# EAGLE design simple_flip_flop (EAGLE 8.6.3)
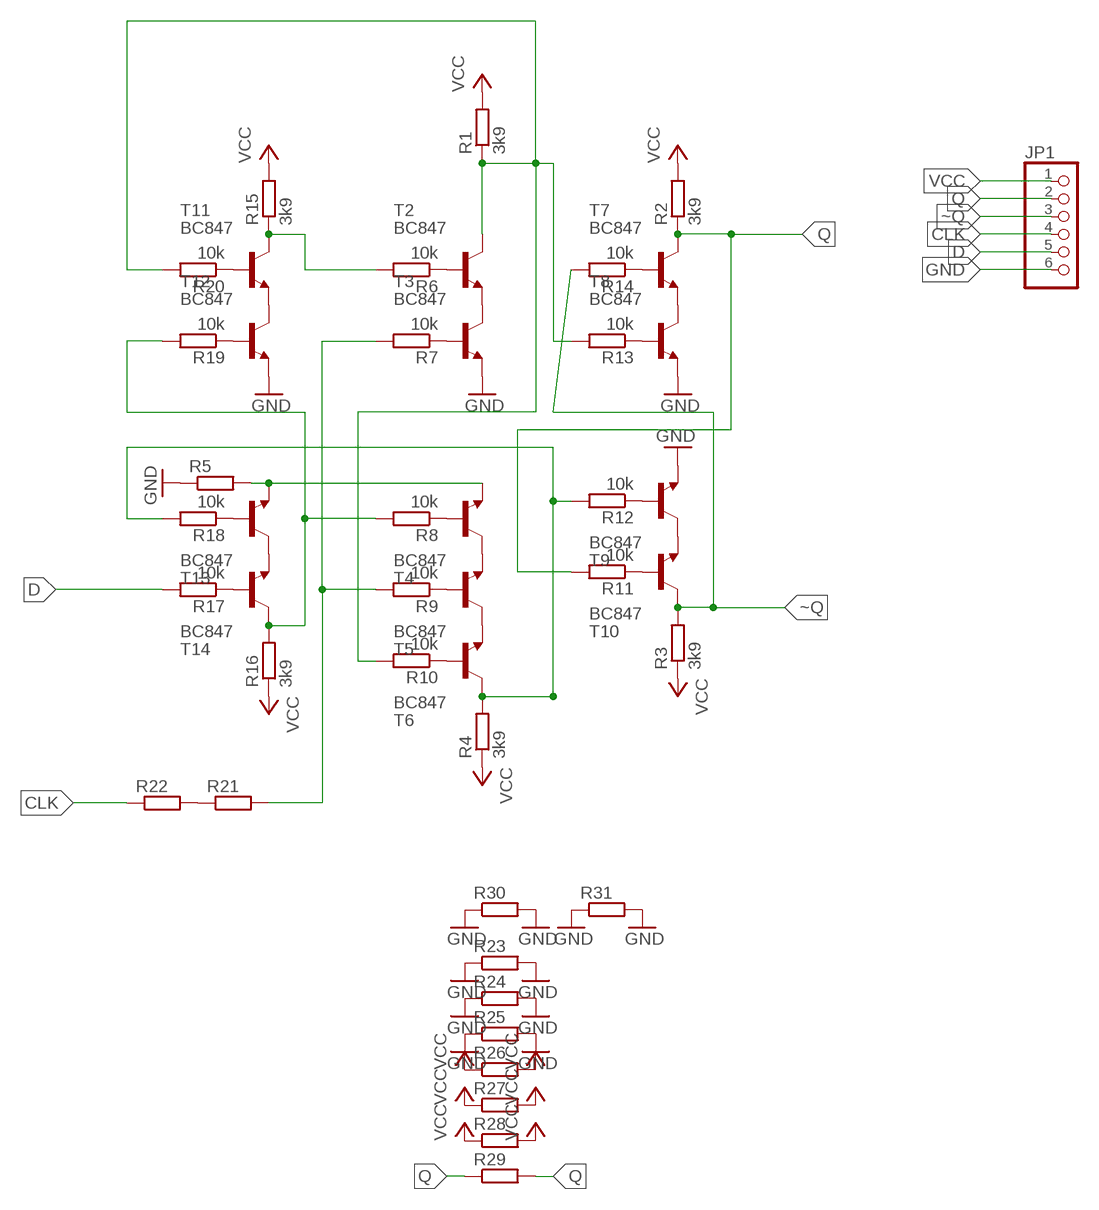
[diagram p0: schematic, sheet 1]

## Parts
JP1  PINHD-1X06_2.54-SMD  [1X06SMD]
R1  3k9  R-EU_R0805W  [R0805W]
R2  3k9  R-EU_R0805W  [R0805W]
R3  3k9  R-EU_R0805W  [R0805W]
R4  3k9  R-EU_R0805W  [R0805W]
R5  R-EU_R1206  [R1206]
R6  10k  R-EU_R0805W  [R0805W]
R7  10k  R-EU_R0805W  [R0805W]
R8  10k  R-EU_R0805W  [R0805W]
R9  10k  R-EU_R0805W  [R0805W]
R10  10k  R-EU_R0805W  [R0805W]
R11  10k  R-EU_R0805W  [R0805W]
R12  10k  R-EU_R0805W  [R0805W]
R13  10k  R-EU_R0805W  [R0805W]
R14  10k  R-EU_R0805W  [R0805W]
R15  3k9  R-EU_R0805W  [R0805W]
R16  3k9  R-EU_R0805W  [R0805W]
R17  10k  R-EU_R0805W  [R0805W]
R18  10k  R-EU_R0805W  [R0805W]
R19  10k  R-EU_R0805W  [R0805W]
R20  10k  R-EU_R0805W  [R0805W]
R21  R-EU_R1206  [R1206]
R22  R-EU_R1206  [R1206]
R23  R-EU_R1206  [R1206]
R24  R-EU_R1206  [R1206]
R25  R-EU_R1206  [R1206]
R26  R-EU_R1206  [R1206]
R27  R-EU_R1206  [R1206]
R28  R-EU_R1206  [R1206]
R29  R-EU_R1206  [R1206]
R30  R-EU_R1206  [R1206]
R31  R-EU_R1206  [R1206]
T2  BC847  [SOT23]
T3  BC847  [SOT23]
T4  BC847  [SOT23]
T5  BC847  [SOT23]
T6  BC847  [SOT23]
T7  BC847  [SOT23]
T8  BC847  [SOT23]
T9  BC847  [SOT23]
T10  BC847  [SOT23]
T11  BC847  [SOT23]
T12  BC847  [SOT23]
T13  BC847  [SOT23]
T14  BC847  [SOT23]

## Nets
CLK: JP1.4 R22.1
D: JP1.5 R17.2
GND: JP1.6 R5.1 R23.1 R23.2 R24.1 R24.2 R25.1 R25.2 R30.1 R30.2 R31.1 R31.2 T3.2(E) T8.2(E) T9.2(E) T12.2(E)
N$1: R5.2 T4.2(E) T13.2(E)
N$2: T2.2(E) T3.3(C)
N$3: T4.3(C) T5.2(E)
N$4: T5.3(C) T6.2(E)
N$5: T7.2(E) T8.3(C)
N$6: T9.3(C) T10.2(E)
N$7: R1.1 R10.2 R13.2 R20.2 T2.3(C)
N$8: R21.1 R22.2
N$10: R4.2 R12.2 R18.2 T6.3(C)
N$12: R6.1 T2.1(B)
N$13: R7.1 T3.1(B)
N$14: R8.1 T4.1(B)
N$15: R9.1 T5.1(B)
N$16: R10.1 T6.1(B)
N$17: R11.1 T10.1(B)
N$18: R12.1 T9.1(B)
N$19: R13.1 T8.1(B)
N$20: R14.1 T7.1(B)
N$23: T11.2(E) T12.3(C)
N$24: T13.3(C) T14.2(E)
N$26: R6.2 R15.1 T11.3(C)
N$27: R8.2 R16.2 R19.2 T14.3(C)
N$29: R17.1 T14.1(B)
N$30: R18.1 T13.1(B)
N$31: R19.1 T12.1(B)
N$32: R20.1 T11.1(B)
Q: JP1.2 R2.1 R11.2 R29.1 R29.2 T7.3(C)
S%9: R7.2 R9.2 R21.2
VCC: JP1.1 R1.2 R2.2 R3.1 R4.1 R15.2 R16.1 R26.1 R26.2 R27.1 R27.2 R28.1 R28.2
~Q: JP1.3 R3.2 R14.2 T10.3(C)

## Library data of the parts
JP1 = pinhead-2:PINHD-1X06: PIN HEADER
R1-R4 R6-R20 R29 = rcl:R-EU_: RESISTOR, European symbol; SPICEPREFIX: R
R5 R21-R28 R30 R31 = resistor:R-EU_: RESISTOR, European symbol
T2-T14 = transistor-neu-to92:BC847: NPN TRANSISTOR

## Board
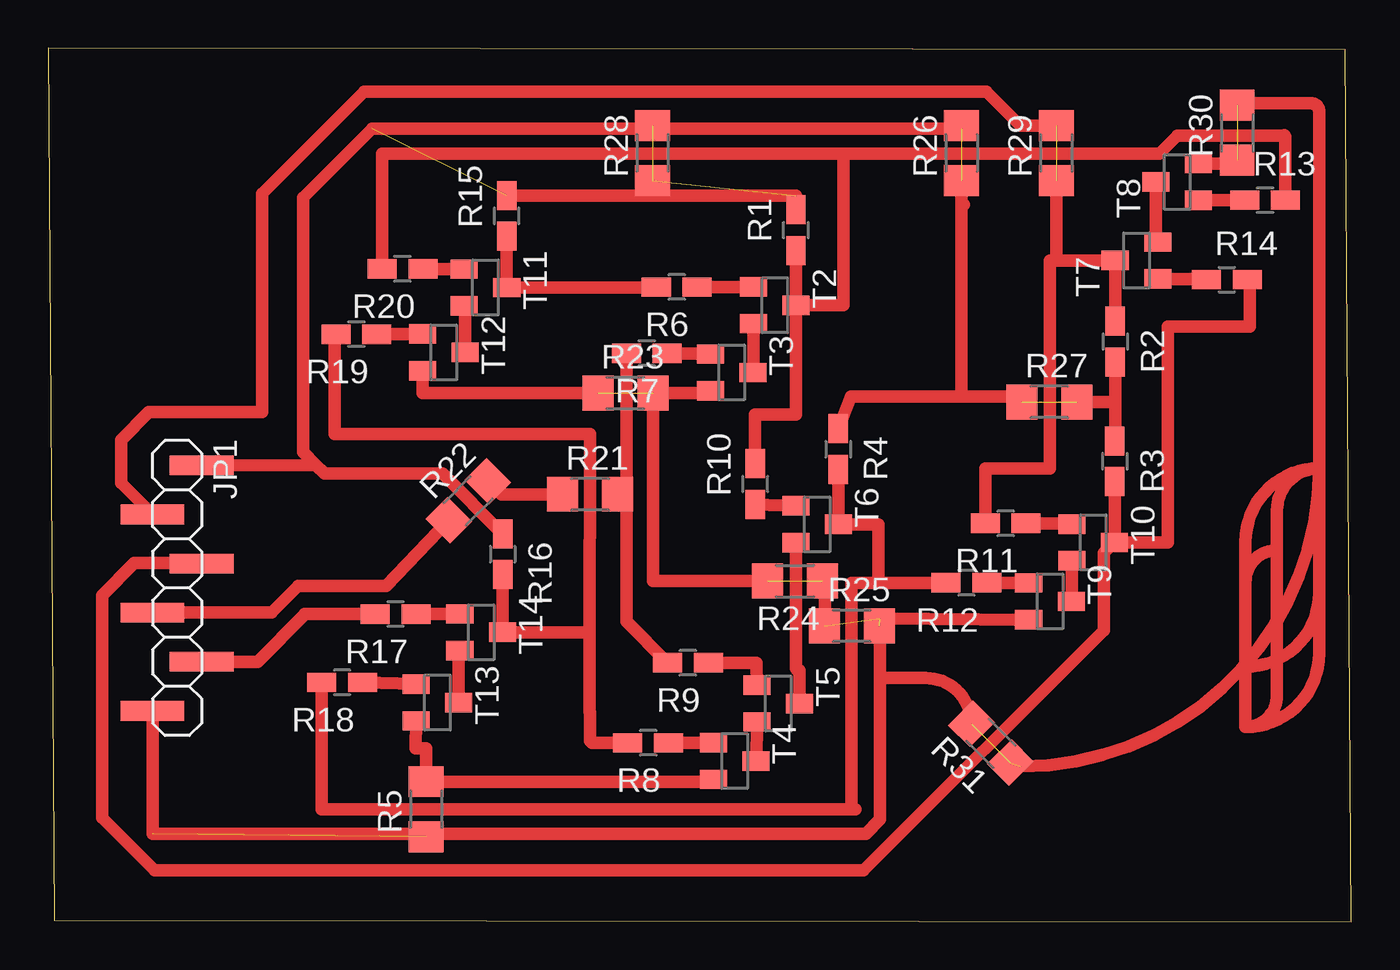
[diagram p1: board, top side]

Size 67.37 x 45.16 mm. Coordinates in mm from the lower left corner, seen from the top.
Outline: 0.3,0.08 67.37,0 67.06,45.08 0,45.16 0.3,0.08
Copper layers (1*16): Top 0.035mm / dielectric 1.5mm / Bottom 0.035mm
Design rules "default *": minimum track width 25mil, minimum drill 0.35mm, track to track 25mil, track to pad 25mil, pad to pad 20mil, via to via 25mil, smd to smd 25mil, copper to edge 40mil, drill to drill 6mil, minimum pad ring 10mil, minimum via ring 8mil, stop-mask expansion 4mil, vias tented up to drill 0mil, thermal gap 10mil

### Footprints (pad centres in the part's own frame; a part is rotated, then mirrored left to right if it is on the bottom)
1X06SMD = smd 1.016 x 3.302: 1 -1.27,1.27; 2 1.27,-1.27; 3 3.81,1.27; 4 6.35,-1.27; 5 8.89,1.27; 6 11.43,-1.27
R0805W = smd 1.5 x 1: 1 -1.052,0; 2 1.052,0
R1206 = smd 1.6 x 1.803: 1 -1.422,0; 2 1.422,0
SOT23 = smd 1 x 1.4: 1 -0.95,-1.1; 2 0.95,-1.1; 3 0,1.1

### Placement (x,y rotation side)
JP1  6.65,22.33 270 top
R1  38.66,35.76 90 top
R2  55.17,30 270 top
R3  55.14,23.8 270 top
R4  40.84,24.43 270 top
R5  19.53,5.82 90 top
R6  32.49,32.82 180 top
R7  30.94,29.39 180 top
R8  31.01,9.25 180 top
R9  33.07,13.39 180 top
R10  36.55,22.63 90 top
R11  49.5,20.6 180 top
R12  47.47,17.53 180 top
R13  62.92,37.31 0 top
R14  60.93,33.2 0 top
R15  23.7,36.5 90 top
R16  23.5,19 270 top
R17  17.96,15.9 180 top
R18  15.19,12.37 180 top
R19  15.93,30.38 180 top
R20  18.31,33.76 180 top
R21  28.02,22.1 0 top
R22  21.72,21.76 45 top
R23  29.84,27.33 0 top
R24  38.6,17.61 180 top
R25  41.55,15.29 0 top
R26  47.22,39.75 90 top
R27  51.77,26.87 0 top
R28  31.24,39.75 90 top
R29  52.12,39.75 90 top
R30  61.47,40.79 90 top
R31  48.74,9.23 135 top
T2  37.57,31.88 270 top
T3  35.33,28.4 270 top
T4  35.48,8.31 270 top
T5  37.74,11.28 270 top
T6  39.75,20.55 270 top
T7  56.26,34.19 90 top
T8  58.37,38.25 90 top
T9  51.79,16.56 270 top
T10  54.03,19.61 270 top
T11  22.61,32.79 270 top
T12  20.45,29.44 270 top
T13  20.12,11.33 270 top
T14  22.38,14.96 270 top

### Tracks (layer width: path | path; a pad name or v marks a point on that pad's centre or on a via)
CLK
  Top 0.635: R22.1 17.46,17.35 12.92,17.35 11.54,15.98 JP1.4
D
  Top 0.635: JP1.5 10.82,13.44 13.26,15.87 13.26,15.9 R17.2
GND  (8 unrouted)
  Top 0.635: 43.01,12.6 43.01,5.29 42.27,4.55 5.38,4.55 JP1.6 | 43.01,12.6 43.01,15.67 T9.2 | R23.1 19.35,27.33 T12.2 | T3.2 34.23,27.33 R23.2 31.27,17.61 R24.2 | R24.1 arc-90 40.18,17.45 R25.1 | T8.2 61.3,39.2 R30.1 | R30.2 arc-90 61.57,42.32 65.3,42.32 arc-90 65.71,41.91 65.71,23.44 | 65.71,23.44 arc-90 50.29,8.03 | R31.2 arc90 45.36,12.6 43.01,12.6 | 65.71,23.44 arc90 61.9,19.63 61.9,17.58 | 61.9,13.18 61.9,10.06 | 61.9,10.06 arc90 65.71,13.87 65.71,16.99 | 65.71,23.44 arc90 63.53,21.26 63.53,19.2 | 61.9,10.06 arc90 63.53,11.68 63.53,19.2 | 65.71,23.44 65.71,16.99 | 65.71,16.99 arc-90 61.9,13.18 | 61.9,13.18 61.9,17.58 | 61.9,17.58 arc-90 63.53,19.2
N$1
  Top 0.635: T13.2 19,8.97 19.53,8.97 R5.2 34.27,7.24 arc90 T4.2
N$2
  Top 0.635: T2.2 36.47,28.4 T3.3
N$3
  Top 0.635: T5.2 36.62,8.31 T4.3
N$4
  Top 0.635: T5.3 38.83,12.42 38.83,12.99 arc-90 38.65,13.16 T6.2
N$5
  Top 0.635: T7.2 57.27,35.14 T8.3
N$6
  Top 0.635: T10.2 52.93,16.56 T9.3
N$7
  Top 0.635: R1.1 38.66,31.88 | 38.66,31.88 T2.3 41.12,31.88 41.12,39.73 | R20.2 17.26,39.73 41.12,39.73 | 41.12,39.73 57.45,39.73 58.37,40.65 63.9,40.65 arc90 63.91,40.67 63.97,40.6 R13.2 | 38.66,31.88 38.66,26.21 36.55,26.21 R10.2
N$8
  Top 0.635: R22.2 23.44,22.1 R21.1
N$10
  Top 0.635: R18.2 14.14,5.82 41.53,5.82 | R12.2 46.42,17.5 42.93,17.5 | R4.2 T6.3 42.93,20.55 42.93,17.5 | 42.93,17.5 41.53,17.5 41.53,8.23 | 41.53,8.23 41.53,5.82 | 41.53,5.82 41.74,5.82 | 41.53,8.23
N$12
  Top 0.635: R6.1 T2.1
N$13
  Top 0.635: R7.1 34.23,29.39 T3.1
N$14
  Top 0.635: R8.1 T4.1
N$15
  Top 0.635: R9.1 36.62,13.39 T5.1
N$16
  Top 0.635: R10.1 T6.1
N$17
  Top 0.635: R11.1 52.93,20.6 T10.1
N$18
  Top 0.635: R12.1 T9.1
N$19
  Top 0.635: R13.1 T8.1
N$20
  Top 0.635: R14.1 59.88,33.24 T7.1
N$23
  Top 0.635: T11.2 21.55,31.84 T12.3
N$24
  Top 0.635: T13.3 21.22,14.06 T14.2
N$26
  Top 0.635: R15.1 T11.3 31.43,32.79 R6.2
N$27
  Top 0.635: R16.2 23.48,17.95 T14.3 27.99,14.96 | R19.2 14.81,30.38 14.81,25.22 28.02,25.22 28.02,24.61 27.99,14.96 | 27.99,14.96 27.99,10.85 28.02,10.82 28.02,9.35 28.12,9.25 R8.2
N$29
  Top 0.635: R17.1 T14.1
N$30
  Top 0.635: R18.1 19.02,12.29 T13.1
N$31
  Top 0.635: R19.1 T12.1
N$32
  Top 0.635: R20.1 19.37,33.74 T11.1
Q  (1 unrouted)
  Top 0.635: R2.1 T7.3 52.12,34.19 | 52.12,34.19 51.79,34.19 51.79,23.42 48.45,23.42 R11.2 | R29.1 52.12,34.19 | R29.2 50.27,41.17 48.51,42.93 16.33,42.93 11.05,37.64 11.05,26.34 5.18,26.34 3.76,24.92 3.76,22.68 JP1.2
S%9
  Top 0.635: R7.2 29.88,22.1 | R21.2 29.88,22.1 | R9.2 29.88,15.52 29.88,22.1
VCC  (5 unrouted)
  Top 0.635: R3.1 55.17,24.85 55.17,26.87 | 55.17,26.87 R2.2 | R15.2 38.66,37.55 R1.2 | R16.1 20.38,23.16 14.28,23.16 13.83,23.61 | 13.83,23.61 13.17,24.28 13.17,37.43 16.73,41 47.22,41 R26.2 | JP1.1 13.83,23.61 | R4.1 41.5,27.15 47.22,27.15 | 47.22,27.15 47.22,37.08 | 47.22,37.08 47.35,37.08 | R26.1 47.22,37.08 | 47.22,27.15 50.34,27.15 R27.1 | R27.2 55.17,26.87
~Q
  Top 0.635: R3.2 55.14,19.61 T10.3 | T10.3 57.89,19.61 57.89,30.76 62.13,30.76 62.13,33.2 R14.2 | T10.3 54.58,19.06 54.58,15.06 42.16,2.64 5.49,2.64 2.78,5.35 2.78,16.88 4.44,18.54 6.73,18.54 JP1.3